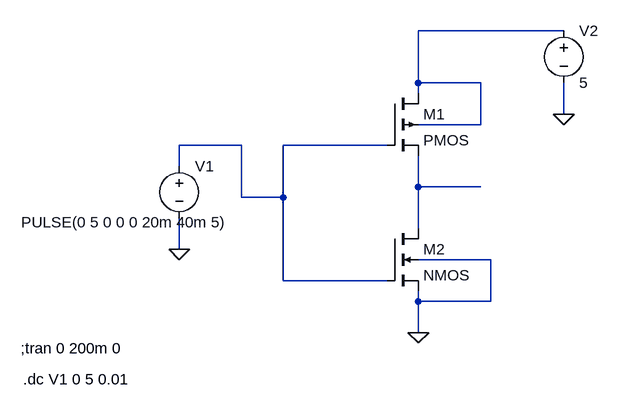
[diagram p0: schematic Inverter LTspice.asc]
Inverter LTspice.asc, the LTspice schematic file:
Version 4
SHEET 1 880 680
WIRE 528 -48 304 -48
WIRE 304 32 304 -48
WIRE 400 32 304 32
WIRE 304 48 304 32
WIRE 528 80 528 32
WIRE 400 96 400 32
WIRE 400 96 304 96
WIRE 32 128 -64 128
WIRE 256 128 96 128
WIRE -64 160 -64 128
WIRE 304 192 304 144
WIRE 400 192 304 192
WIRE 32 208 32 128
WIRE 96 208 96 128
WIRE 96 208 32 208
WIRE 304 256 304 192
WIRE -64 288 -64 240
WIRE 416 304 304 304
WIRE 96 336 96 208
WIRE 256 336 96 336
WIRE 304 368 304 352
WIRE 416 368 416 304
WIRE 416 368 304 368
WIRE 304 416 304 368
FLAG 304 416 0
FLAG 528 80 0
FLAG -64 288 0
SYMBOL pmos4 256 48 R0
SYMATTR InstName M1
SYMBOL nmos4 256 256 R0
SYMATTR InstName M2
SYMBOL voltage -64 144 R0
WINDOW 3 -243 102 Left 2
WINDOW 123 0 0 Left 0
WINDOW 39 0 0 Left 0
SYMATTR InstName V1
SYMATTR Value PULSE(0 5 0 0 0 20m 40m 5)
SYMBOL voltage 528 -64 R0
WINDOW 123 0 0 Left 0
WINDOW 39 0 0 Left 0
SYMATTR InstName V2
SYMATTR Value 5
TEXT -308 440 Left 2 !;tran 0 200m 0
TEXT -304 488 Left 2 !.dc V1 0 5 0.01

The netlist it stands for:
* Inverter LTspice.asc
M1 N001 N002 N003 N001 PMOS
M2 N003 N002 0 0 NMOS
V1 N002 0 PULSE(0 5 0 0 0 20m 40m 5)
V2 N001 0 5
.model NMOS NMOS
.model PMOS PMOS
.lib standard.mos
;tran 0 200m 0
.dc V1 0 5 0.01
.backanno
.end